# EasyEDA Pro project Project_Custom_Segmented_Display_2025-12-29.epro

# Schematic Schematic1
Board Name: Board1; Create Date: 2025-12-24; Page Name: P1; Project Name: Tactile Remote Desk; Schematic Name: Schematic1; Update Date: 2025-12-26; Company: EasyEDA.com; Page Size: A4; Version: V1.0
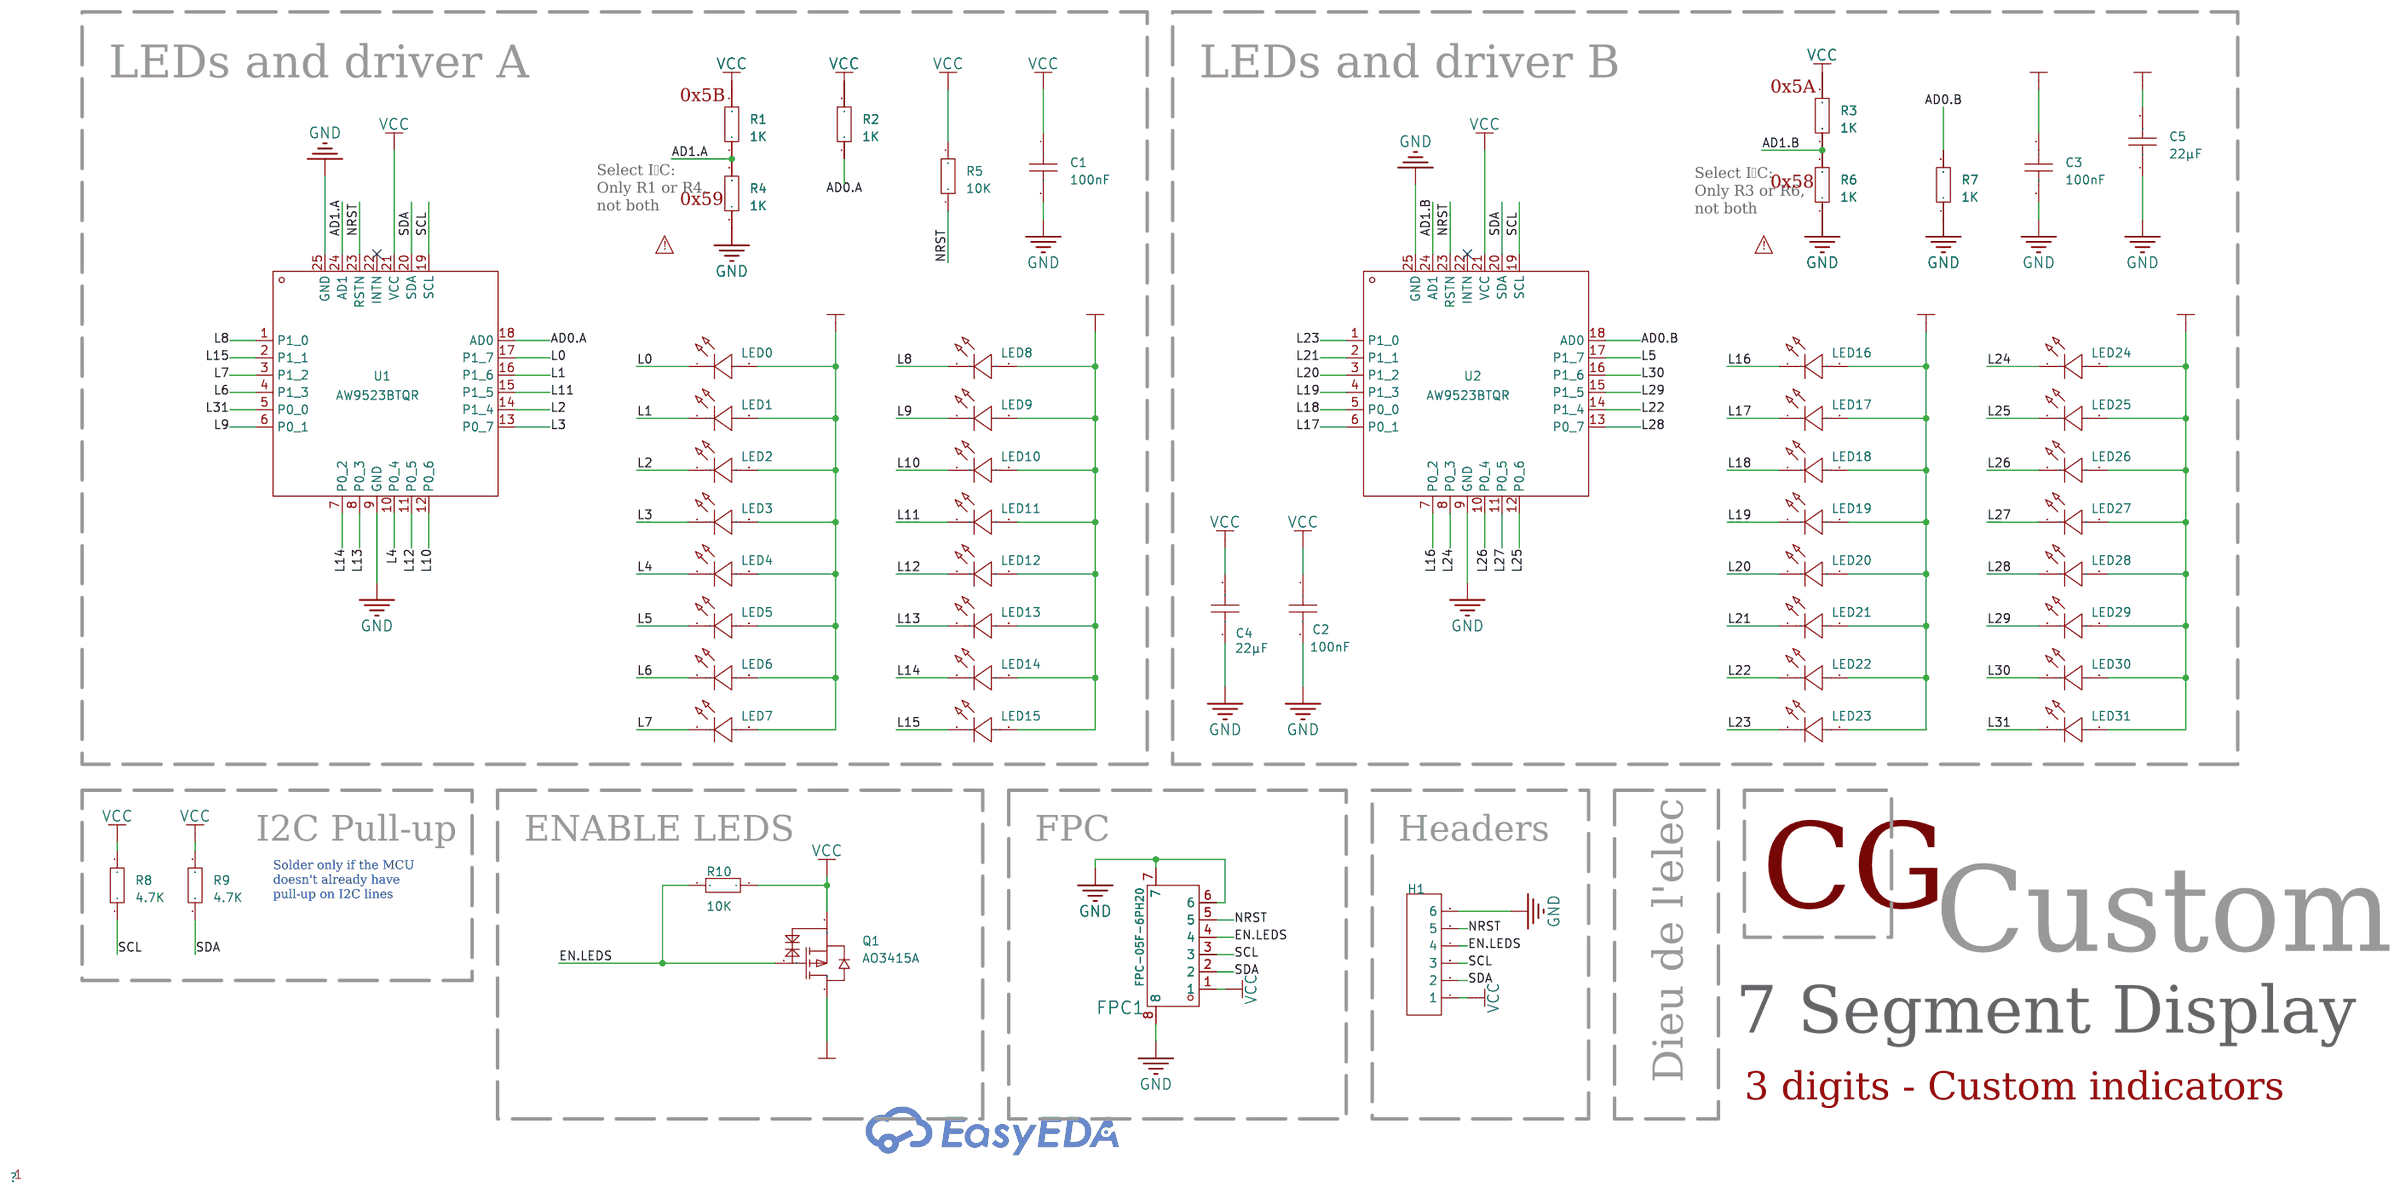
[diagram p0: schematic sheet]

## Parts
C1  100nF  [C0603]
C2  100nF  [C0603]
C3  100nF  [C0603]
C4  22µF  [C0805]
C5  22µF  [C0805]
FPC1  FPC-05F-6PH20  [FPC-SMD_6P-P0.50_XUNPU_FPC-05F-6PH20]
H1  -  [HDR-TH_6P-P2.54-V-M-1]
LED0  XL-1608SURC-06  [LED 0603 clear]
LED1  XL-1608SURC-06  [LED 0603 clear]
LED2  XL-1608SURC-06  [LED 0603 clear]
LED3  XL-1608SURC-06  [LED 0603 clear]
LED4  XL-1608SURC-06  [LED 0603 clear]
LED5  XL-1608SURC-06  [LED 0603 clear]
LED6  XL-1608SURC-06  [LED 0603 clear]
LED7  XL-1608SURC-06  [LED 0603 clear]
LED8  XL-1608SURC-06  [LED 0603 clear]
LED9  XL-1608SURC-06  [LED 0603 clear]
LED10  XL-1608SURC-06  [LED 0603 clear]
LED11  XL-1608SURC-06  [LED 0603 clear]
LED12  XL-1608SURC-06  [LED 0603 clear]
LED13  XL-1608SURC-06  [LED 0603 clear]
LED14  XL-1608SURC-06  [LED 0603 clear]
LED15  XL-1608SURC-06  [LED 0603 clear]
LED16  XL-1608SURC-06  [LED 0603 clear]
LED17  XL-1608SURC-06  [LED 0603 clear]
LED18  XL-1608SURC-06  [LED 0603 clear]
LED19  XL-1608SURC-06  [LED 0603 clear]
LED20  XL-1608SURC-06  [LED 0603 clear]
LED21  XL-1608SURC-06  [LED 0603 clear]
LED22  XL-1608SURC-06  [LED 0603 clear]
LED23  XL-1608SURC-06  [LED 0603 clear]
LED24  XL-1608SURC-06  [LED 0603 clear]
LED25  XL-1608SURC-06  [LED 0603 clear]
LED26  XL-1608SURC-06  [LED 0603 clear]
LED27  XL-1608SURC-06  [LED 0603 clear]
LED28  XL-1608SURC-06  [LED 0603 clear]
LED29  XL-1608SURC-06  [LED 0603 clear]
LED30  XL-1608SURC-06  [LED 0603 clear]
LED31  XL-1608SURC-06  [LED 0603 clear]
Q1  AO3415A  [SOT-23-3_L2.9-W1.6-P1.90-LS2.8-BR]
R1  1K  [R0402]
R2  1K  [R0402]
R3  1K  [R0402]
R4  1K  [R0402]
R5  10K  [R0402]
R6  1K  [R0402]
R7  1K  [R0402]
R8  4.7K  [R0603]
R9  4.7K  [R0603]
R10  10K  [R0402]
U1  AW9523BTQR  [VFQFPN-24_L4.0-W4.0-P0.50-BL-EP2.8]
U2  AW9523BTQR  [VFQFPN-24_L4.0-W4.0-P0.50-BL-EP2.8]

## Library data of the parts
C1-C3 = CAP_0603: Supplier Footprint: 0603
C4 C5 = CAP_0805: Supplier Footprint: 0805
FPC1 = FPC-05F-6PH20: Locking Feature:Hinged Lid Contact Type:Surface Mount Number of Contacts:6P Pitch:0.5mm Mounting Type:Bottom Contact FFC, FCB Thickness:0.3mm FFC, FCB Thickness:0.3mm Height Above Board:2mm Contact Material:Phosphor Bronze Contact Plating:Tin Operating Te; LCSC Part Name: 翻盖式 卧贴 P数:6P 间距:0.5mm; Supplier Part: C2856796; Manufacturer: XUNPU(讯普); Supplier Footprint: SMD,P=0.5mm,卧贴; JLCPCB Part Class: Extended Part; Datasheet: https://item.szlcsc.com/datasheet/FPC-05F-6PH20/3056894.html; Supplier: LCSC; Locking Feature: Hinged Lid; Contact Type: Surface Mount; Number of Contacts: 6P; Pitch: 0.5mm; Mounting Type: Bottom Contact; FFC, FCB Thickness: 0.3mm; Height Above Board: 2mm; Contact Material: Phosphor Bronze; Contact Plating: Tin; Operating Temperature: -25℃~+85℃; Rated Voltage (Max): 50V; Current Rating (Max): 500mA
H1 = HDR-M_2.54_1x6P: Supplier Footprint: Through
LED0-LED31 = XL-1608SURC-06: Lamp Holder Type:- Illumination Color:Red Voltage - Forward(Vf):2.3V Voltage - Forward(Vf):2.3V Power(Watts):50mW Forward Current:20mA Wavelength - Dominant:620nm~630nm Wavelength - Dominant:620nm~630nm Peak Wavelength:625nm Diode Configuration:- Lens Col; Supplier Part: C965799; Manufacturer: XINGLIGHT(成兴光); Supplier Footprint: 0603; JLCPCB Part Class: Extended Part; Datasheet: https://atta.szlcsc.com/upload/public/pdf/source/20250213/F9766CE804AF391355DCDD48DB3E0DAB.pdf; Supplier: LCSC; Illumination Color: Red; Voltage - Forward(Vf): 2.3V; Power(Watts): 50mW; Forward Current: 20mA; Wavelength - Dominant: 620nm~630nm; Peak Wavelength: 625nm; Lens Color: Colorless Transparent Lens; Luminous Intensity: 225mcd; Viewing Angle: 120°; Mounting Sytle: Positive Stick; Operating Temperature: -20℃~+85℃
Q1 = AO3415A_C133233: Type:1 Piece P-Channel Drain Source Voltage (Vdss): Continuous Drain Current (Id): Drain Source On Resistance (RDS(on)@Vgs,Id):65mΩ@1.8V,2A Power Dissipation (Pd): Gate Threshold Voltage (Vgs(th)@Id):570mV@250uA Total Gate Charge (Qg@Vgs):11nC@4.5V Input; LCSC Part Name: 1个P沟道 耐压:20V 电流:5A; Supplier Part: C133233; Manufacturer: AOS; Supplier Footprint: SOT-23; JLCPCB Part Class: Extended Part; Datasheet: https://atta.szlcsc.com/upload/public/pdf/source/20171014/C133233_15079754867981038216.pdf; Supplier: LCSC; Type: 1 Piece P-Channel; Drain Source On Resistance (RDS(on)@Vgs,Id): 65mΩ@1.8V,2A; Gate Threshold Voltage (Vgs(th)@Id): 570mV@250uA; Total Gate Charge (Qg@Vgs): 11nC@4.5V; Input Capacitance (Ciss@Vds): 905pF@10V; Reverse Transfer Capacitance (Crss@Vds): 115pF@10V; Operating Temperature: -55℃~+150℃
R1-R7 R10 = Res_0402: Supplier Footprint: 0402
R8 R9 = Res_0603: Supplier Footprint: 0603
U1 U2 = AW9523BTQR: Interface:I2C Number of I/O:16 Interrupt Output:With Interrupt Output Output Type: Supply Voltage:2.4V~5.5V Supply Voltage:2.4V~5.5V Output Source current:- Output Sink Current:- Clock Frequency:400kHz Operating Temperature:-40℃~+85℃ Operating Temperature; LCSC Part Name: AW9523B产品手册; Supplier Part: C148077; Manufacturer: AWINIC(艾为); Supplier Footprint: TQFN-24-EP(4x4); JLCPCB Part Class: Extended Part; Datasheet: https://atta.szlcsc.com/upload/public/pdf/source/20180202/C148077_15175644676151336003.pdf; Supplier: LCSC; Interface: I2C; Number of I/O: 16; Interrupt Output: With Interrupt Output; Supply Voltage: 2.4V~5.5V; Clock Frequency: 400kHz; Operating Temperature: -40℃~+85℃

## Nets
GND: C1.2 C2.2 C3.2 C4.1 C5.1 FPC1.6 FPC1.7 FPC1.8 H1.6 R4.1 R6.1 R7.1 U1.9(GND) U1.25(GND) U2.9(GND) U2.25(GND)
VCC: C1.1 C2.1 C4.2 FPC1.1 H1.1 Q1.2(S) R1.2 R2.2 R3.2 R5.2 R8.2 R9.2 R10.1 U1.21(VCC) U2.21(VCC)
VCC.LED: C3.1 C5.2 LED0.2(A) LED1.2(A) LED2.2(A) LED3.2(A) LED4.2(A) LED5.2(A) LED6.2(A) LED7.2(A) LED8.2(A) LED9.2(A) LED10.2(A) LED11.2(A) LED12.2(A) LED13.2(A) LED14.2(A) LED15.2(A) LED16.2(A) LED17.2(A) LED18.2(A) LED19.2(A) LED20.2(A) LED21.2(A) LED22.2(A) LED23.2(A) LED24.2(A) LED25.2(A) LED26.2(A) LED27.2(A) LED28.2(A) LED29.2(A) LED30.2(A) LED31.2(A) Q1.3(D)
AD0.A: R2.1 U1.18(AD0)
AD0.B: R7.2 U2.18(AD0)
AD1.A: R1.1 R4.2 U1.24(AD1)
AD1.B: R3.1 R6.2 U2.24(AD1)
EN.LEDS: FPC1.4 H1.4 Q1.1(G) R10.2
L0: LED0.1(K) U1.17(P1_7)
L1: LED1.1(K) U1.16(P1_6)
L2: LED2.1(K) U1.14(P1_4)
L3: LED3.1(K) U1.13(P0_7)
L4: LED4.1(K) U1.10(P0_4)
L5: LED5.1(K) U2.17(P1_7)
L6: LED6.1(K) U1.4(P1_3)
L7: LED7.1(K) U1.3(P1_2)
L8: LED8.1(K) U1.1(P1_0)
L9: LED9.1(K) U1.6(P0_1)
L10: LED10.1(K) U1.12(P0_6)
L11: LED11.1(K) U1.15(P1_5)
L12: LED12.1(K) U1.11(P0_5)
L13: LED13.1(K) U1.8(P0_3)
L14: LED14.1(K) U1.7(P0_2)
L15: LED15.1(K) U1.2(P1_1)
L16: LED16.1(K) U2.7(P0_2)
L17: LED17.1(K) U2.6(P0_1)
L18: LED18.1(K) U2.5(P0_0)
L19: LED19.1(K) U2.4(P1_3)
L20: LED20.1(K) U2.3(P1_2)
L21: LED21.1(K) U2.2(P1_1)
L22: LED22.1(K) U2.14(P1_4)
L23: LED23.1(K) U2.1(P1_0)
L24: LED24.1(K) U2.8(P0_3)
L25: LED25.1(K) U2.12(P0_6)
L26: LED26.1(K) U2.10(P0_4)
L27: LED27.1(K) U2.11(P0_5)
L28: LED28.1(K) U2.13(P0_7)
L29: LED29.1(K) U2.15(P1_5)
L30: LED30.1(K) U2.16(P1_6)
L31: LED31.1(K) U1.5(P0_0)
NRST: FPC1.5 H1.5 R5.1 U1.23(RSTN) U2.23(RSTN)
SCL: FPC1.3 H1.3 R8.1 U1.19(SCL) U2.19(SCL)
SDA: FPC1.2 H1.2 R9.1 U1.20(SDA) U2.20(SDA)

Not connected (* = marked no-connect by the designer): U1 22(INTN)*; U2 22(INTN)*

## Notes on the sheet
- LEDs and driver A
- LEDs and driver B
- 0x5A
- 0x5B
- 0x58
- Select I²C:
  Only R1 or R4,
  not both
- 0x59
- Select I²C:
  Only R3 or R6,
  not both
- !
- !
- I2C Pull-up
- ENABLE LEDS
- FPC
- Headers
- Solder only if the MCU
  doesn't already have
  pull-up on I2C lines
- CG
- Custom
- 7 Segment Display
- Dieu de l'elec
- 3 digits - Custom indicators

# Board PCB1
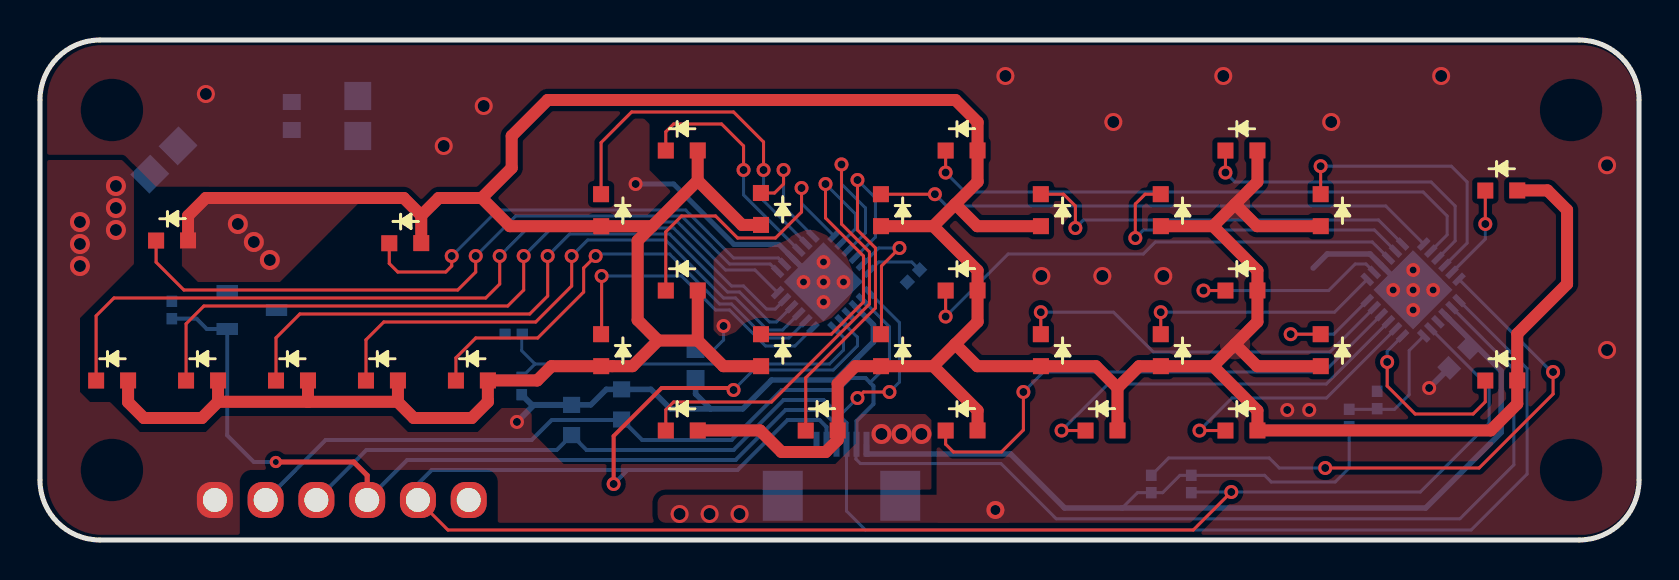
[diagram p1: board, top side]
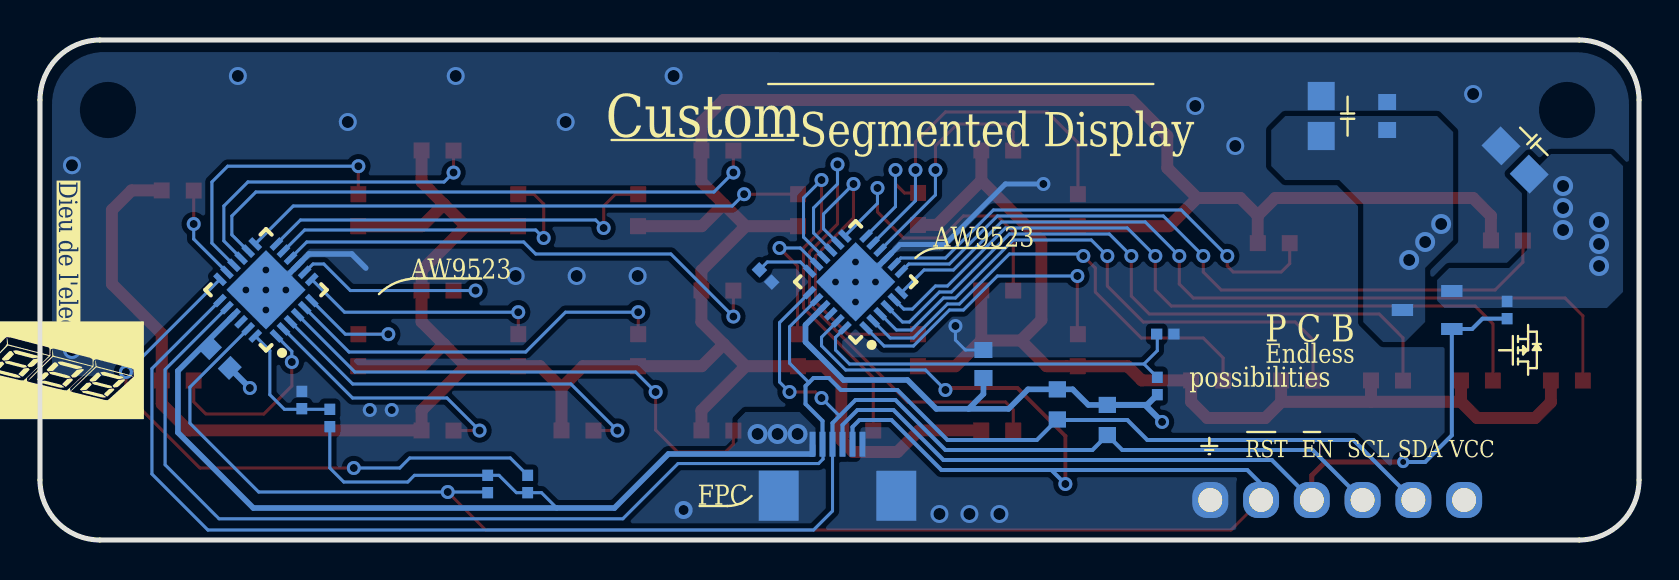
[diagram p2: board, bottom side, seen from below]

Outline 80 x 25 mm; copper layers: Top Layer, Bottom Layer. Coordinates in mm from the lower left corner of the outline.
Outline path: 0,22 0,3 arc(0.88,0.88) 3,0 77,0 arc(79.12,0.88) 80,3 80,22 arc(79.12,24.12) 77,25 3,25 arc(0.88,24.12) 0,22
Stack: Top Layer 0.035mm / Dielectric1 1.51mm FR4 er 4.5 / Bottom Layer 0.035mm

## Design rules (mm)
template: Custom Config
spacing copperThickness1oz (default): track to track 0.102, other pairs 0.152 to 0.3
spacing copperThickness2oz: track to track 0.203, other pairs 0.152 to 0.3
track width copperThickness1oz (default): min 0.127, default 0.254, max 2.54
track width copperThickness2oz: min 0.203, default 0.254, max 2.54
differential pair differentialPair (default): width min 0.127, default 0.254, max 2.54; gap min 0.152, default 0.152
via viaSize (default): diameter min 0.5, default 0.61, max 10; hole min 0.3, default 0.305, max 6.3

## Placement (name value [footprint] x y rotation side)
C1  100nF  [C0603]  71 9.1 225 bottom
C2  100nF  [C0603]  32.8 8.8 90 bottom
C3  100nF  [C0603]  12.6 21.2 90 bottom
C4  22µF  [C0805]  6.2 19 225 bottom
C5  22µF  [C0805]  15.9 21.2 270 bottom
FPC1  FPC-05F-6PH20  [FPC-SMD_6P-P0.50_XUNPU_FPC-05F-6PH20]  40.1 3.5 180 bottom
H1  -  [HDR-TH_6P-P2.54-V-M-1]  15.1 2 0 top
LED0  XL-1608SURC-06  [LED 0603 clear]  73.1 17.5 0 top
LED1  XL-1608SURC-06  [LED 0603 clear]  64.1 16.5 270 top
LED2  XL-1608SURC-06  [LED 0603 clear]  46.1 19.5 0 top
LED3  XL-1608SURC-06  [LED 0603 clear]  42.1 16.5 270 top
LED4  XL-1608SURC-06  [LED 0603 clear]  46.1 12.5 0 top
LED5  XL-1608SURC-06  [LED 0603 clear]  42.1 9.5 270 top
LED6  XL-1608SURC-06  [LED 0603 clear]  46.1 5.5 0 top
LED7  XL-1608SURC-06  [LED 0603 clear]  53.1 5.5 0 top
LED8  XL-1608SURC-06  [LED 0603 clear]  73.1 8 0 top
LED9  XL-1608SURC-06  [LED 0603 clear]  64.1 9.5 270 top
LED10  XL-1608SURC-06  [LED 0603 clear]  50.1 16.5 270 top
LED11  XL-1608SURC-06  [LED 0603 clear]  60.1 19.5 0 top
LED12  XL-1608SURC-06  [LED 0603 clear]  56.1 16.5 270 top
LED13  XL-1608SURC-06  [LED 0603 clear]  60.1 12.5 0 top
LED14  XL-1608SURC-06  [LED 0603 clear]  56.1 9.5 270 top
LED15  XL-1608SURC-06  [LED 0603 clear]  60.1 5.5 0 top
LED16  XL-1608SURC-06  [LED 0603 clear]  6.6 15 0 top
LED17  XL-1608SURC-06  [LED 0603 clear]  3.6 8 0 top
LED18  XL-1608SURC-06  [LED 0603 clear]  8.1 8 0 top
LED19  XL-1608SURC-06  [LED 0603 clear]  12.6 8 0 top
LED20  XL-1608SURC-06  [LED 0603 clear]  17.1 8 0 top
LED21  XL-1608SURC-06  [LED 0603 clear]  21.6 8 0 top
LED22  XL-1608SURC-06  [LED 0603 clear]  36.1 9.5 270 top
LED23  XL-1608SURC-06  [LED 0603 clear]  28.1 9.5 270 top
LED24  XL-1608SURC-06  [LED 0603 clear]  18.27 14.87 0 top
LED25  XL-1608SURC-06  [LED 0603 clear]  36.1 16.56 270 top
LED26  XL-1608SURC-06  [LED 0603 clear]  32.1 19.5 0 top
LED27  XL-1608SURC-06  [LED 0603 clear]  28.1 16.5 270 top
LED28  XL-1608SURC-06  [LED 0603 clear]  32.1 12.5 0 top
LED29  XL-1608SURC-06  [LED 0603 clear]  32.1 5.5 0 top
LED30  XL-1608SURC-06  [LED 0603 clear]  39.1 5.5 0 top
LED31  XL-1608SURC-06  [LED 0603 clear]  50.1 9.5 270 top
Q1  AO3415A  [SOT-23-3_L2.9-W1.6-P1.90-LS2.8-BR]  10.6 11.5 180 bottom
R1  1K  [R0402]  65.5 6.1 270 bottom
R2  1K  [R0402]  55.6 2.8 270 bottom
R3  1K  [R0402]  24.1 7.7 270 bottom
R4  1K  [R0402]  66.9 7 270 bottom
R5  10K  [R0402]  57.6 2.8 90 bottom
R6  1K  [R0402]  23.7 10.3 0 bottom
R7  1K  [R0402]  43.7 13.2 45 bottom
R8  4.7K  [R0603]  26.6 6 90 bottom
R9  4.7K  [R0603]  29.1 6.78 90 bottom
R10  10K  [R0402]  6.6 11.5 270 bottom
U1  AW9523BTQR  [VFQFPN-24_L4.0-W4.0-P0.50-BL-EP2.8]  68.7 12.5 135 bottom
U2  AW9523BTQR  [VFQFPN-24_L4.0-W4.0-P0.50-BL-EP2.8]  39.2 12.9 135 bottom

## Footprints (pads in the part's own frame, mm; a bottom-side part is the same pattern mirrored in y, then rotated)
C0603
  rect 0.8x0.9 smd: 1(-0.7,0) 2(0.7,0)
C0805
  rect 1.41x1.35 smd: 1(-1,0) 2(1,0)
FPC-SMD_6P-P0.50_XUNPU_FPC-05F-6PH20
  rect 0.3x1.25 smd: 1(-1.25,1.288) 2(-0.75,1.288) 3(-0.25,1.288) 4(0.25,1.288) 5(0.75,1.288) 6(1.25,1.288)
  rect 2x2.5 smd: 7(2.94,-1.288) 8(-2.94,-1.288)
HDR-TH_6P-P2.54-V-M-1
  rrect 1.8x1.8 hole 1.2: 1(-6.35,0) 2(-3.81,0) 3(-1.27,0) 4(1.27,0) 5(3.81,0) 6(6.35,0)
LED 0603 clear
  rect 0.8x0.8 smd: 1(-0.79,-0.028) 2(0.808,-0.021)
R0402
  rect 0.566x0.54 smd: 1(-0.433,0) 2(0.433,0)
R0603
  rect 0.806x0.864 smd: 1(-0.753,0) 2(0.753,0)
SOT-23-3_L2.9-W1.6-P1.90-LS2.8-BR
  rect 1.07x0.6 smd: 1(1.235,-0.95) 2(1.235,0.95) 3(-1.235,0)
VFQFPN-24_L4.0-W4.0-P0.50-BL-EP2.8
  rect 0.28x0.7 smd: 1(-1.25,-2) 2(-0.75,-2) 3(-0.25,-2) 4(0.25,-2) 5(0.75,-2) 6(1.25,-2) 13(1.25,2) 14(0.75,2) 15(0.25,2) 16(-0.25,2) 17(-0.75,2) 18(-1.242,2)
  rect 0.7x0.28 smd: 7(2,-1.25) 8(2,-0.75) 9(2,-0.25) 10(2,0.25) 11(2,0.75) 12(2,1.25) 19(-2,1.25) 20(-2,0.75) 21(-2,0.25) 22(-2,-0.25) 23(-2,-0.75) 24(-2,-1.25)
  rect 2.8x2.8 smd: 25(0.013,0)

## Nets
As in the schematic.

Pads without a net: U1 22; U2 22

## Via types
v1: diameter 0.9, hole 0.6, Top Layer to Bottom Layer, 16 vias
v2: diameter 0.7, hole 0.35, Top Layer to Bottom Layer, 10 vias
v3: diameter 0.9, hole 0.5, Top Layer to Bottom Layer, 1 via
v4: diameter 0.7, hole 0.4, Top Layer to Bottom Layer, 45 vias
v5: diameter 1, hole 0.6, Top Layer to Bottom Layer, 12 vias
v6: diameter 0.61, hole 0.305, Top Layer to Bottom Layer, 1 via

## Routing (per net, layer and track width the routed paths; a pad name or vN(x,y) marks a point on that pad's centre or on a via; arc(x,y) is an arc through that point)
GND: length 21.2
  Bottom Layer w0.153: v4(34.2,10.7) 34.2,10 33.7,9.5 C2.2
  Bottom Layer w0.254: 37.61,14.14 36.97,14.78 34.72,14.78 31.7,17.8 v4(29.8,17.8)
  Bottom Layer w0.28: 37.61,14.14 38.84,12.91 U2.25 ; 63.7,13.6 64.4,14.3 66.55,14.3 68.34,12.51 U1.25
  Bottom Layer w0.3: 70.51,8.61 v4(69.5,7.6)
  vias: v1(8.3,22.3) v1(20.2,19.7) v1(22.2,21.7) v1(32,1.3) v1(33.5,1.3) v1(35,1.3) v1(48.3,23.2) v1(50.1,13.2) v1(53.15,13.2) v1(53.7,20.9) v1(56.2,13.2) v1(59.2,23.2) v1(64.6,20.9) v1(70.1,23.2) v1(78.4,18.74) v1(78.4,9.5) v2(38.2,12.9) v2(39.2,13.9) v2(39.2,12.9) v2(39.2,11.9) v2(40.2,12.9) v2(67.7,12.5) v2(68.7,13.5) v2(68.7,12.5) v2(68.7,11.5) v2(69.7,12.5) v3(47.8,1.5) v4(62.4,6.5) v4(63.5,6.5)
VCC: length 81.6
  Bottom Layer w0.153: R1.2 65.5,3.6 64.8,2.9 61.6,2.9 61.27,3.23 57.03,3.23 56.17,2.37 R2.2 54.91,2.37 54.14,1.6
  Bottom Layer w0.28: 33.54,6.56 35.16,6.56 36.6,8 39.8,8 41.7,9.9 41.7,10.75 40.79,11.66 ; 33.54,6.56 32.8,7.3 C2.1 ; 33.54,6.56 31.54,6.56 30.57,7.53 R9.2 28.33,7.53 27.55,6.75 R8.2 ; 70.29,11.26 73.1,8.45 73.1,5.38 69.32,1.6 51.26,1.6 48.56,4.3 41.35,4.3 41.35,4.75
  Bottom Layer w0.3: 24.71,6.75 v4(23.86,5.9) ; 24.71,6.75 R8.2 ; 24.71,6.75 24.61,6.75 24.1,7.27
  vias: v5(2,15.9) v5(2,14.8) v5(2,13.7) v5(3.8,17.7) v5(3.8,16.6) v5(3.8,15.5) v5(42.1,5.3) v5(43.1,5.3) v5(44.1,5.3)
VCC.LED: length 228.8
  Top Layer w0.6: 59.79,16.79 60.89,15.69 64.08,15.69 ; 59.79,16.79 58.69,15.69 ; 59.79,16.79 60.91,17.91 LED11.2 ; LED29.2 36.02,5.48 37.1,4.4 39.31,4.4 39.91,5 LED30.2 39.91,7.81 40.79,8.69 44.69,8.69 ; 19.07,16.23 LED24.2 ; 19.07,16.23 18.2,17.1 8.3,17.1 7.41,16.21 LED16.2 ; 19.07,16.23 19.95,17.1 22.1,17.1 ; 58.69,15.69 60.91,13.47 LED13.2 60.91,10.91 59.79,9.79 ; 58.69,15.69 56.08,15.69 ; 32.9,17.97 30.63,15.69 ; 32.9,17.97 35.12,15.75 LED25.2 ; 32.9,17.97 32.9,19.54 ; 30.63,15.69 29.9,14.97 29.9,11 30.93,9.97 ; 30.63,15.69 23.51,15.69 22.1,17.1 ; 13.41,6.91 LED19.2 ; 13.41,6.91 8.93,6.91 8.91,6.89 8.91,6.91 ; 13.41,6.91 17.91,6.91 ; 53.91,7.61 52.83,8.69 46.89,8.69 45.79,9.79 ; 53.91,7.61 54.99,8.69 58.69,8.69 ; 53.91,7.61 LED7.2 ; 44.69,15.69 46.91,13.47 LED4.2 46.91,10.91 45.79,9.79 ; 44.69,15.69 45.79,16.79 ; 44.69,15.69 42.08,15.69 ; 8.91,6.91 LED18.2 ; 8.91,6.91 8.1,6.1 5.2,6.1 4.41,6.89 LED17.2 ; 45.79,16.79 46.89,15.69 50.08,15.69 ; 45.79,16.79 46.91,17.91 LED2.2 46.91,20.89 45.8,22 25.4,22 23.6,20.2 23.6,18.6 22.1,17.1 ; 58.69,8.69 60.91,6.47 LED15.2 72.58,5.48 73.91,6.81 LED8.2 73.91,10.31 76.4,12.8 76.4,16.5 75.42,17.48 LED0.2 ; 58.69,8.69 59.79,9.79 ; LED6.2 46.91,6.47 44.69,8.69 ; 45.79,9.79 44.69,8.69 ; 59.79,9.79 60.89,8.69 64.08,8.69 ; 17.91,6.91 17.91,6.89 18.7,6.1 21.6,6.1 22.41,6.91 LED21.2 24.88,7.98 25.59,8.69 29.64,8.69 30.93,9.97 ; 17.91,6.91 LED20.2 ; 30.93,9.97 32.91,9.97 ; 36.08,8.69 34.19,8.69 32.91,9.97 ; LED28.2 32.91,9.97
  vias: v5(9.9,15.8) v5(10.7,14.9) v5(11.5,14)
AD0.A: length 29.9
  Top Layer w0.153: v4(75.7,8.4) 75.7,7.3 72,3.6 v4(64.3,3.6)
  Bottom Layer w0.153: 55.6,3.23 56.47,4.1 61.5,4.1 62,3.6 v4(64.3,3.6) ; U1.18 75.63,8.4 v4(75.7,8.4)
AD0.B: length 2.9
  Bottom Layer w0.153: R7.2 43.61,13.9 41.96,13.9 U2.18
AD1.A: length 6.5
  Bottom Layer w0.153: U1.24 68.5,9.47 68.5,7.26 67.77,6.53 65.5,6.53
AD1.B: length 19.8
  Bottom Layer w0.153: 24.77,8.8 24.1,9.47 24.1,10.23 24.03,10.3 ; 24.77,8.8 39.5,8.8 40.2,9.5 40.2,10.13 U2.24 ; 24.77,8.8 R3.1
EN.LEDS: length 44
  Top Layer w0.254: H1.4 16.37,3.23 15.7,3.9 v6(11.8,3.9)
  Bottom Layer w0.2: 6.6,11.07 7.83,11.07 8.35,10.55 Q1.1 9.36,5.23 10.7,3.9 v6(11.8,3.9) ; H1.4 18.37,4 34.8,4 37.3,6.5 39.1,6.5 39.85,5.75 FPC1.4
L0: length 4.8
  Top Layer w0.153: LED0.1 v4(72.31,15.8)
  Bottom Layer w0.153: v4(72.31,15.8) 72.31,15.05 U1.17
L1: length 13.7
  Top Layer w0.153: LED1.1 v4(64.07,18.69)
  Bottom Layer w0.153: v4(64.07,18.69) 70.61,18.69 71.4,17.9 71.4,14.85 70.29,13.74
L2: length 29.2
  Top Layer w0.153: v4(45.31,18.37) LED2.1
  Bottom Layer w0.153: U1.14 70.4,15.26 70.4,16.2 69.2,17.4 46.28,17.4 v4(45.31,18.37)
L3: length 28.2
  Top Layer w0.153: v4(44.77,17.29) LED3.1
  Bottom Layer w0.153: v4(44.77,17.29) 45.36,16.7 67.33,16.7 U1.13
L4: length 25.3
  Top Layer w0.153: LED4.1 v4(45.31,11.17)
  Bottom Layer w0.153: v4(45.31,11.17) 48.44,14.3 55.2,14.3 55.8,14.9 66.65,14.9 67.46,14.09
L5: length 6.9
  Top Layer w0.153: LED5.1 42.1,10.32 42.1,13.7 v4(43,14.6)
  Bottom Layer w0.153: v4(43,14.6) 41.96,14.6 U2.17
L6: length 26.6
  Top Layer w0.153: LED6.1 45.31,4.79 45.7,4.4 48.1,4.4 49.2,5.5 v4(49.2,7.4)
  Bottom Layer w0.153: v4(49.2,7.4) 50.2,8.4 64.25,8.4 67.11,11.26
L7: length 19.8
  Top Layer w0.153: v4(51.11,5.47) LED7.1
  Bottom Layer w0.153: 67.46,10.91 64.35,7.8 53.44,7.8 v4(51.11,5.47)
L8: length 9.6
  Top Layer w0.153: LED8.1 72.31,6.91 71.7,6.3 68.8,6.3 67.4,7.7 v4(67.4,8.9)
  Bottom Layer w0.153: U1.1 67.4,9.43 v4(67.4,8.9)
L9: length 6
  Top Layer w0.153: v4(62.57,10.29) LED9.1
  Bottom Layer w0.153: U1.6 64.72,10.29 v4(62.57,10.29)
L10: length 20.1
  Top Layer w0.153: v4(51.8,15.6) 51.8,16.7 51.21,17.29 LED10.1
  Bottom Layer w0.153: U1.12 66.97,16 52.2,16 v4(51.8,15.6)
L11: length 16.2
  Top Layer w0.153: LED11.1 v4(59.31,18.37)
  Bottom Layer w0.153: v4(59.31,18.37) 59.78,17.9 69.6,17.9 70.8,16.7 70.8,14.95 69.94,14.09
L12: length 16.8
  Top Layer w0.153: v4(54.8,15.1) 54.8,16.8 55.29,17.29 LED12.1
  Bottom Layer w0.153: U1.11 66.76,15.5 55.2,15.5 v4(54.8,15.1)
L13: length 10.4
  Top Layer w0.153: LED13.1 v4(58.21,12.47)
  Bottom Layer w0.153: U1.8 66.34,13.8 65.8,13.8 64.47,12.47 v4(58.21,12.47)
L14: length 12.1
  Top Layer w0.153: LED14.1 v4(56.07,11.39)
  Bottom Layer w0.153: v4(56.07,11.39) 64.76,11.39 U1.7
L15: length 13.2
  Top Layer w0.153: LED15.1 v4(58.01,5.47)
  Bottom Layer w0.153: U1.2 64.36,7.1 59.64,7.1 v4(58.01,5.47)
L16: length 35.9
  Top Layer w0.153: v4(21.8,14.2) 21.8,13.4 20.9,12.5 7.2,12.5 5.81,13.89 LED16.1
  Bottom Layer w0.153: v4(21.8,14.2) 23.8,16.2 32.1,16.2 34.5,13.8 36.53,13.8 U2.7
L17: length 41.6
  Top Layer w0.153: v4(23,14.2) 23,12.8 22.3,12.1 3.7,12.1 2.81,11.21 LED17.1
  Bottom Layer w0.153: v4(23,14.2) 24.7,15.9 31.9,15.9 34.3,13.5 35.77,13.5 U2.6
L18: length 37.6
  Top Layer w0.153: v4(24.2,14.2) 24.2,12.5 23.4,11.7 8.2,11.7 7.31,10.81 LED18.1
  Bottom Layer w0.153: v4(24.2,14.2) 25.6,15.6 31.7,15.6 34.6,12.7 35.2,12.7 36.35,11.55 36.79,11.55 U2.5
L19: length 33.4
  Top Layer w0.153: LED19.1 11.81,10.11 13,11.3 24.5,11.3 25.4,12.2 v4(25.4,14.2)
  Bottom Layer w0.153: v4(25.4,14.2) 26.5,15.3 31.5,15.3 34.4,12.4 35,12.4 36.5,10.9 36.85,10.9 37.61,11.66
L20: length 28.8
  Top Layer w0.153: LED20.1 16.31,10.01 17.2,10.9 24.8,10.9 26.6,12.7 v4(26.6,14.2)
  Bottom Layer w0.153: v4(26.6,14.2) 27.4,15 31.3,15 34.2,12.1 34.8,12.1 36.4,10.5 37.15,10.5 37.96,11.31
L21: length 23.6
  Top Layer w0.153: v4(27.8,14.2) 27.2,13.6 27.2,12.4 24.9,10.1 21.8,10.1 20.81,9.11 LED21.1
  Bottom Layer w0.153: v4(27.8,14.2) 27.9,14.3 31.5,14.3 34,11.8 34.6,11.8 36.3,10.1 37.46,10.1 U2.2
L22: length 16.4
  Top Layer w0.153: LED22.1 39.59,10.29 41.2,11.9 41.2,14.2 39.3,16.1 v4(39.3,17.8)
  Bottom Layer w0.153: U2.14 40.8,15.56 40.8,16.3 v4(39.3,17.8)
L23: length 15.3
  Top Layer w0.153: v4(28.1,13.2) 28.1,10.32 LED23.1
  Bottom Layer w0.153: U2.1 37.77,9.7 36.3,9.7 34.5,11.5 33.8,11.5 32.1,13.2 v4(28.1,13.2)
L24: length 23.7
  Top Layer w0.153: v4(20.6,14.2) 20.6,13.7 20.3,13.4 17.9,13.4 17.48,13.82 LED24.1
  Bottom Layer w0.153: v4(20.6,14.2) 22.9,16.5 32.3,16.5 34.7,14.1 36.94,14.1 U2.8
L25: length 5.9
  Top Layer w0.153: LED25.1 36.75,17.35 37.2,17.8 v4(37.2,18.5)
  Bottom Layer w0.153: U2.12 37.2,16.67 v4(37.2,18.5)
L26: length 11.8
  Top Layer w0.153: v4(35.2,18.5) 35.2,19.7 34.1,20.8 31.7,20.8 31.31,20.41 LED26.1
  Bottom Layer w0.153: 37.96,14.49 35.2,17.25 v4(35.2,18.5)
L27: length 17.9
  Top Layer w0.153: LED27.1 28.07,19.87 29.6,21.4 34.7,21.4 36.2,19.9 v4(36.2,18.5)
  Bottom Layer w0.153: U2.11 36.2,16.96 v4(36.2,18.5)
L28: length 15.3
  Top Layer w0.153: v4(38.1,17.6) 38.1,16.4 36.8,15.1 34.9,15.1 33.8,16.2 32.1,16.2 31.31,15.41 LED28.1
  Bottom Layer w0.153: U2.13 38.1,16.83 v4(38.1,17.6)
L29: length 26.1
  Top Layer w0.153: LED29.1 31.31,6.51 31.7,6.9 36.6,6.9 41.5,11.8 41.5,14.4 40.1,15.8 v4(40.1,18.78)
  Bottom Layer w0.153: 40.44,14.49 41.3,15.35 41.3,16.6 40.1,17.8 v4(40.1,18.78)
L30: length 19
  Top Layer w0.153: v4(40.9,18) 40.9,15.5 41.8,14.6 41.8,11.6 38.31,8.11 LED30.1
  Bottom Layer w0.153: v4(40.9,18) 41.8,17.1 41.8,15.15 40.79,14.14
L31: length 19.5
  Top Layer w0.153: LED31.1 v4(50.07,11.39)
  Bottom Layer w0.153: U1.5 64.54,9.4 55.7,9.4 53.71,11.39 v4(50.07,11.39)
NRST: length 107.1
  Top Layer w0.153: v4(59.6,2.4) 57.7,0.5 20.41,0.5 H1.5
  Top Layer w0.2: v4(34.7,7.5) 34.6,7.6 31.1,7.6 28.7,5.2 v4(28.7,2.8)
  Bottom Layer w0.153: U1.23 72.5,7.64 72.5,5.84 69.06,2.4 v4(59.6,2.4) 57.67,2.4 57.6,2.47 ; U2.23 40.9,10.14 40.9,9.71 39.69,8.5 35.7,8.5 v4(34.7,7.5)
  Bottom Layer w0.2: 29.4,3.5 19.6,3.5 18.91,2.81 H1.5 ; 29.4,3.5 34.9,3.5 37.4,6 39,6 39.35,5.65 FPC1.5 ; 29.4,3.5 v4(28.7,2.8)
SCL: length 88.6
  Top Layer w0.153: v4(42.5,7.4) 41.2,7.4 v4(40.9,7.1)
  Bottom Layer w0.153: FPC1.3 40.35,1.45 41.3,0.5 71.6,0.5 74.4,3.3 74.4,8.57 U1.19 ; U2.19 43,10.87 43,7.9 v4(42.5,7.4) ; v4(40.9,7.1) 40.01,6.21 40.01,6.19
  Bottom Layer w0.2: FPC1.3 40.35,5.85 39.2,7 37.2,7 34.7,4.5 27.35,4.5 R8.1 25.85,4.5 16.33,4.5 H1.3
SDA: length 87.5
  Bottom Layer w0.153: U2.20 42.5,10.66 42.5,8.84 41.53,7.87 ; 40.82,4.79 40.82,4.04 41.04,3.82 48.08,3.82 50.84,1.06 71.04,1.06 73.74,3.76 73.74,8.52 U1.20
  Bottom Layer w0.2: FPC1.2 40.85,5.95 41.7,6.8 41.7,7.7 41.3,8.1 40.53,8.1 39.93,7.5 37.1,7.5 34.6,5 30.13,5 R9.1 29.07,6 25.6,6 24.6,5 14.29,5 H1.2

## Copper pours and planes (outline as drawn; the poured copper is in the pictures)
GND on Top Layer: -1.08,26.17 80.82,26.17 80.82,-1.43 -1.08,-1.43
GND on Top Layer: 33.7,15.5 40.7,15.5 40.7,10.2 33.7,10.2
GND on Top Layer: 30.9,2.26 48.8,2.26 48.8,0.86 30.9,0.86
GND on Bottom Layer: -1,26.2 80.9,26.2 80.9,-1.4 -1,-1.4
VCC on Top Layer: 44.6,-0.6 44.6,6 44.3,6.3 41.1,6.3 40.8,6 40.8,4.8 39.8,3.8 26.2,3.8 24.6,5.4 24.6,6.3 24.3,6.6 23.1,6.6 21.9,5.4 18.4,5.4 17.6,6.2 9.1,6.2 8.3,5.4 5,5.4 3.5,6.9 2.5,6.9 2,7.4 2,11.1 4.7,13.8 4.7,18.4 4.1,19 -0.1,19 -2.9,16.2 -2.9,-0.6
VCC on Bottom Layer: 41.2,6.4 45.83,6.4 45.83,4.2 41.2,4.2
VCC on Bottom Layer: 0.8,19.3 10.1,19.3 10.1,11.6 0.8,11.6
VCC.LED on Top Layer: 7.1,17.1 16,17.1 16,12.9 7.1,12.9
VCC.LED on Bottom Layer: 9.3,21.2 18.4,21.2 18.4,9.9 9.3,9.9

## Text on the board
Bottom Solder Mask Layer: Dieu de l'elec | CG | One
Bottom Silkscreen Layer: VCC | SDA | SCL | EN | RST | Dieu de l'elec | Endless | possibilities | AW9523 | FPC | P C B | Segmented Display | Custom
Document Layer: Opensource is love | 26.12.2025 | C. GAILLARD #Dieu de l'élec / Custom Segmented Display
